# Altium schematic sheet fpga-bank4.SchDoc: FPGA - Bank 4
size Legal; CheckedBy: J. Brinton; CompanyName: Signal Laboratories, Inc.; DrawnBy: J. Brinton; Engineer: J. Brinton; Address1: 3479 Edison Way; Address2: Menlo Park CA 94025; Address3: +1 (877) 778-8435; Address4: siglabs.com; DocumentNumber: 31; Revision: 2b; SheetNumber: 32; SheetTotal: 58
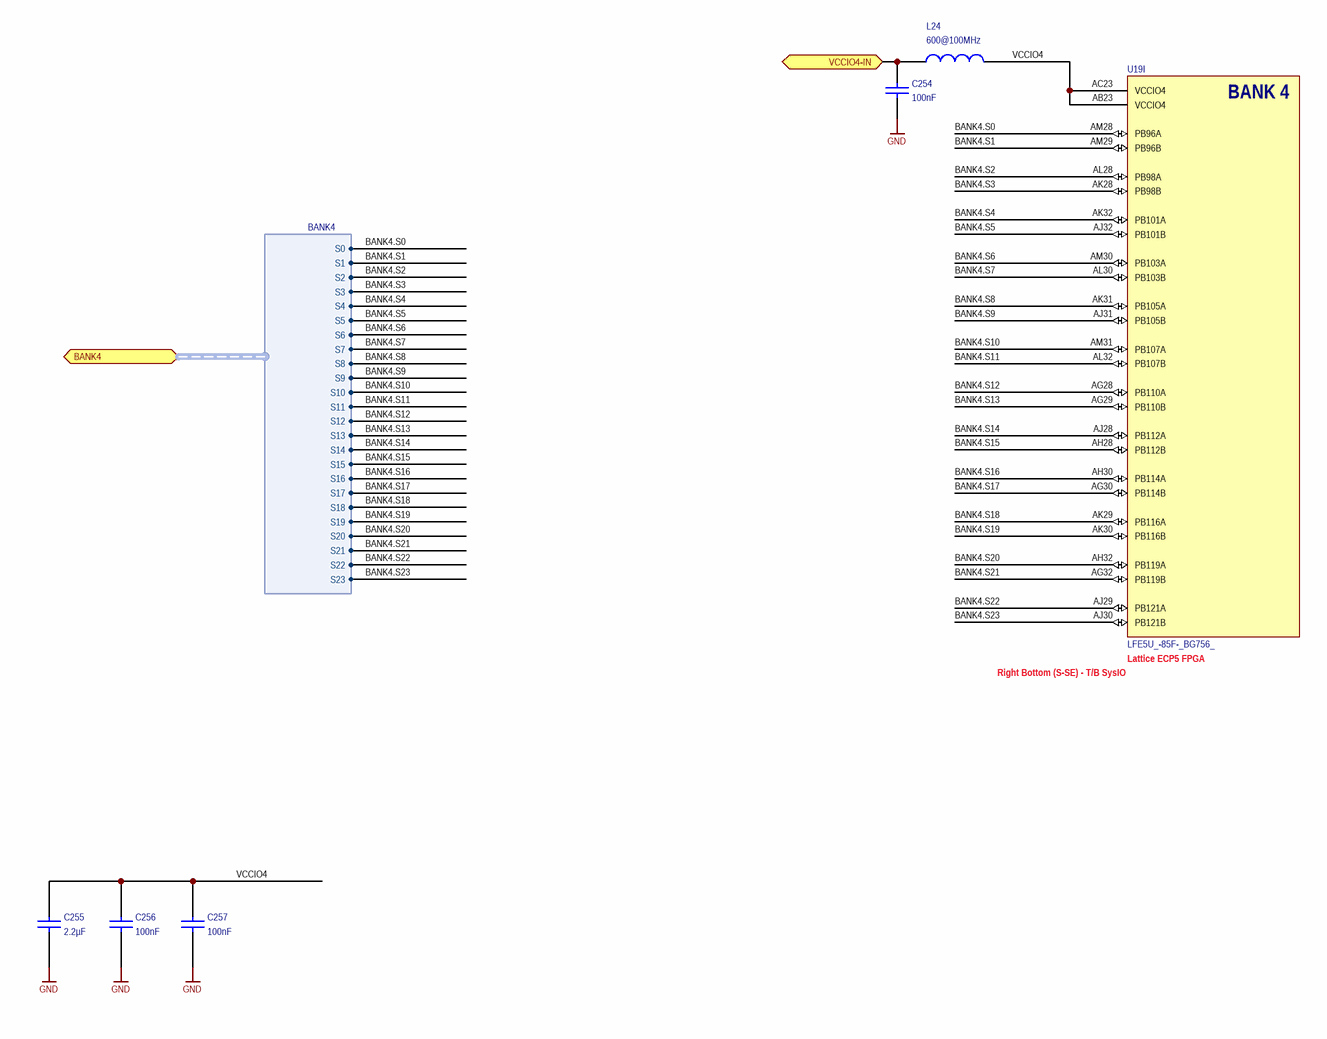
[diagram p0: fpga-bank4.SchDoc]

## Parts
C254  value 100nF  [CAPC1005X56N]  (hidden comment: GRM155R71C104KA88J)
C255  value 2.2µF  [CAPC1608X90N]  (hidden comment: GRM21BR71C225KA12L)
C256  value 100nF  [CAPC1005X56N]  (hidden comment: GRM155R71C104KA88J)
C257  value 100nF  [CAPC1005X56N]  (hidden comment: GRM155R71C104KA88J)
L24  value 600@100MHz  [0402]  (hidden comment: BLM15PX601SN1D)
U19  LFE5U_-85F-_BG756_  [caBGA756]  (part I of 19)

## Ports
BANK4 (harness BANK4), VCCIO4-IN

## Harnesses
BANK4: S0, S1, S2, S3, S4, S5, S6, S7, S8, S9, S10, S11, S12, S13, S14, S15, S16, S17, S18, S19, S20, S21, S22, S23

## Nets
GND: C254.1 C255.1 C256.1 C257.1
BANK4.S0: U19.AM28(PB96A) ; port BANK4.S0
BANK4.S1: U19.AM29(PB96B) ; port BANK4.S1
BANK4.S2: U19.AL28(PB98A) ; port BANK4.S2
BANK4.S3: U19.AK28(PB98B) ; port BANK4.S3
BANK4.S4: U19.AK32(PB101A) ; port BANK4.S4
BANK4.S5: U19.AJ32(PB101B) ; port BANK4.S5
BANK4.S6: U19.AM30(PB103A) ; port BANK4.S6
BANK4.S7: U19.AL30(PB103B) ; port BANK4.S7
BANK4.S8: U19.AK31(PB105A) ; port BANK4.S8
BANK4.S9: U19.AJ31(PB105B) ; port BANK4.S9
BANK4.S10: U19.AM31(PB107A) ; port BANK4.S10
BANK4.S11: U19.AL32(PB107B) ; port BANK4.S11
BANK4.S12: U19.AG28(PB110A) ; port BANK4.S12
BANK4.S13: U19.AG29(PB110B) ; port BANK4.S13
BANK4.S14: U19.AJ28(PB112A) ; port BANK4.S14
BANK4.S15: U19.AH28(PB112B) ; port BANK4.S15
BANK4.S16: U19.AH30(PB114A) ; port BANK4.S16
BANK4.S17: U19.AG30(PB114B) ; port BANK4.S17
BANK4.S18: U19.AK29(PB116A) ; port BANK4.S18
BANK4.S19: U19.AK30(PB116B) ; port BANK4.S19
BANK4.S20: U19.AH32(PB119A) ; port BANK4.S20
BANK4.S21: U19.AG32(PB119B) ; port BANK4.S21
BANK4.S22: U19.AJ29(PB121A) ; port BANK4.S22
BANK4.S23: U19.AJ30(PB121B) ; port BANK4.S23
VCCIO4: C255.2 C256.2 C257.2 L24.1 U19.AB23(VCCIO4) U19.AC23(VCCIO4)
VCCIO4-IN: C254.2 L24.2 ; port VCCIO4-IN

## Notes on the sheet
- (near U19) Right Bottom (S-SE) - T/B SysIO
- (near U19) Lattice ECP5 FPGA
- Title
- Engineer
- Revision
- Drawn By
- Checked By
- Date
- Sheet
- of
- (in symbol LFE5U_-85F-_BG756_, part I) BANK 4

## Library data of the parts
C254 C256 C257 = GRM155R71A104KA01J: Ceramic Capacitor 100nF ±10% 16V X7R 0402; Manufacturer: Murata; Tr: -55:125; Manufacturer P/N: GRM155R71C104KA88J; Tolerance: ±10%; Package: 0402; Voltage: 16V
C255 = GRM188R71A225KE15D: Ceramic Capacitor 2.2uF ±10% 10V X7R 0603; Manufacturer: Murata; Tr: -55:125; Manufacturer P/N: GRM188R71A225KE15D; Tolerance: ±10%; Package: 0603; Voltage: 10V
L24 = IND 0402: Ferrite Bead 600-Ohm @ 100MHz 900mA 0402; Manufacturer: Murata; Tolerance: ±25%; Tr: -55:125; Manufacturer P/N: BLM15PX601SN1D; Package: 0402
U19 = LFE5U_-85F-_BG756_: ECP5 FPGA, 85k LUT, 756-caBGA; Manufacturer: Lattice Semiconductor; Manufacturer P/N: LFE5U_-85F-_BG756_